# Altium schematic sheet Power.SchDoc
size A; SheetNumber: 6; SheetTotal: 17
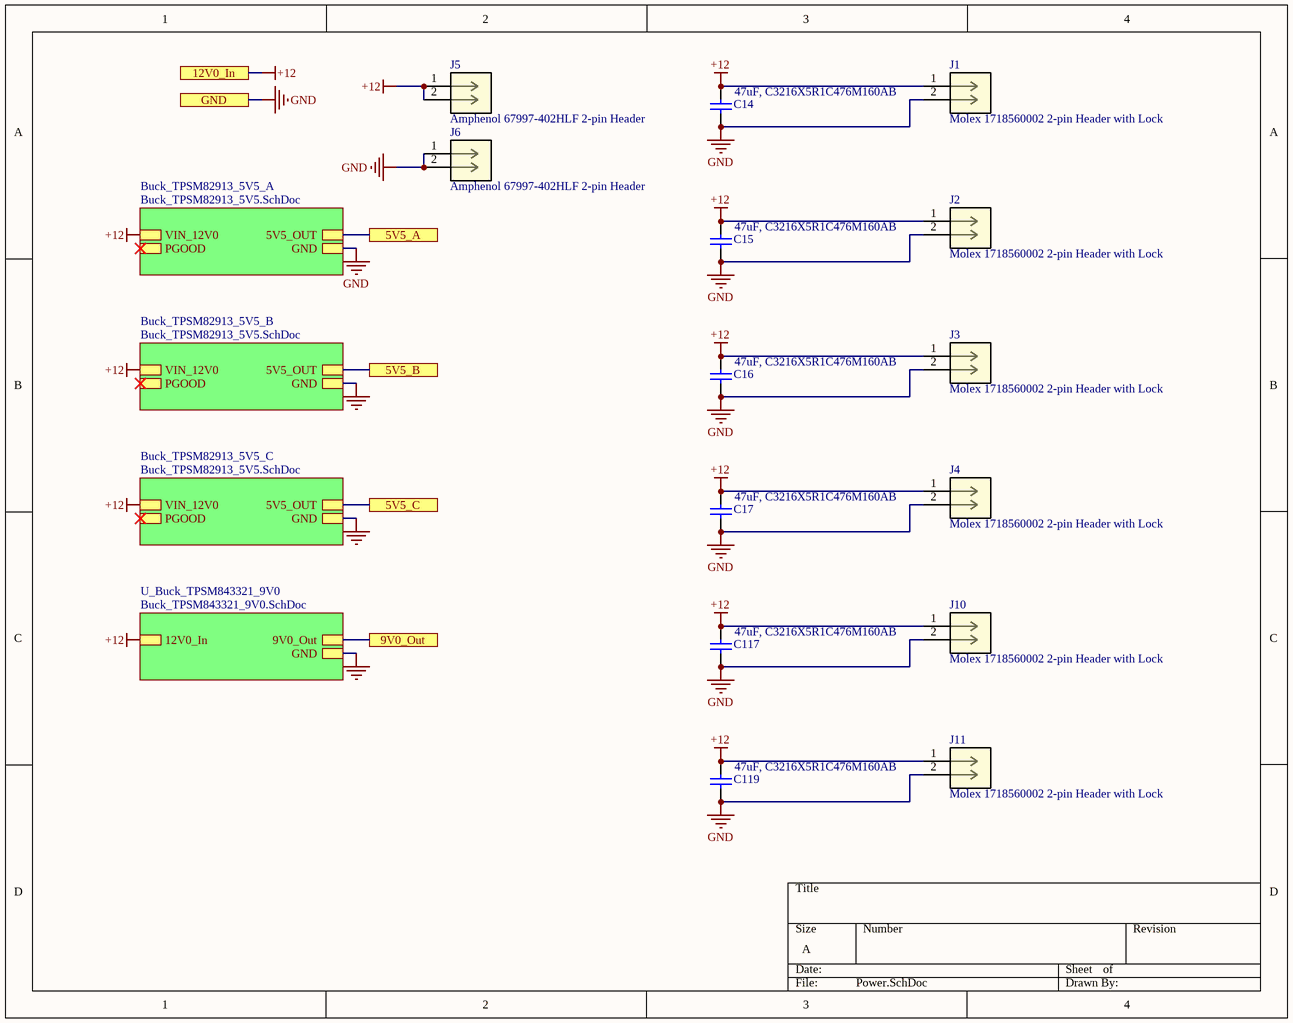
[diagram p0: Power.SchDoc]

## Parts
C14  47uF, C3216X5R1C476M160AB  [SMD-1206]
C15  47uF, C3216X5R1C476M160AB  [SMD-1206]
C16  47uF, C3216X5R1C476M160AB  [SMD-1206]
C17  47uF, C3216X5R1C476M160AB  [SMD-1206]
C117  47uF, C3216X5R1C476M160AB  [SMD-1206]
C119  47uF, C3216X5R1C476M160AB  [SMD-1206]
J1  Molex 1718560002 2-pin Header with Lock  [Molex 1718560002 2-pin header with lock]
J2  Molex 1718560002 2-pin Header with Lock  [Molex 1718560002 2-pin header with lock]
J3  Molex 1718560002 2-pin Header with Lock  [Molex 1718560002 2-pin header with lock]
J4  Molex 1718560002 2-pin Header with Lock  [Molex 1718560002 2-pin header with lock]
J5  Amphenol 67997-402HLF 2-pin Header  [Amphenol  67997-402HLF 2-pin header]
J6  Amphenol 67997-402HLF 2-pin Header  [Amphenol  67997-402HLF 2-pin header]
J10  Molex 1718560002 2-pin Header with Lock  [Molex 1718560002 2-pin header with lock]
J11  Molex 1718560002 2-pin Header with Lock  [Molex 1718560002 2-pin header with lock]

## Sub-sheets
Buck_TPSM82913_5V5_A = Buck_TPSM82913_5V5.SchDoc: GND, VIN_12V0, PGOOD, 5V5_OUT
Buck_TPSM82913_5V5_B = Buck_TPSM82913_5V5.SchDoc: GND, VIN_12V0, PGOOD, 5V5_OUT
Buck_TPSM82913_5V5_C = Buck_TPSM82913_5V5.SchDoc: GND, VIN_12V0, PGOOD, 5V5_OUT
U_Buck_TPSM843321_9V0 = Buck_TPSM843321_9V0.SchDoc: 9V0_Out, 12V0_In, GND

## Ports
5V5_A, 5V5_B, 5V5_C, 9V0_Out, 12V0_In, GND

## Nets
+12: C14.2 C15.2 C16.2 C17.2 C117.2 C119.2 J1.1 J2.1 J3.1 J4.1 J5.1 J5.2 J10.1 J11.1 ; port 12V0_In, sheet Buck_TPSM82913_5V5_A/VIN_12V0, sheet Buck_TPSM82913_5V5_B/VIN_12V0, sheet Buck_TPSM82913_5V5_C/VIN_12V0, sheet U_Buck_TPSM843321_9V0/12V0_In
GND: C14.1 C15.1 C16.1 C17.1 C117.1 C119.1 J1.2 J2.2 J3.2 J4.2 J6.1 J6.2 J10.2 J11.2 ; port GND, sheet Buck_TPSM82913_5V5_A/GND, sheet Buck_TPSM82913_5V5_B/GND, sheet Buck_TPSM82913_5V5_C/GND, sheet U_Buck_TPSM843321_9V0/GND
5V5_A: port 5V5_A, sheet Buck_TPSM82913_5V5_A/5V5_OUT
5V5_B: port 5V5_B, sheet Buck_TPSM82913_5V5_B/5V5_OUT
5V5_C: port 5V5_C, sheet Buck_TPSM82913_5V5_C/5V5_OUT
9V0_Out: port 9V0_Out, sheet U_Buck_TPSM843321_9V0/9V0_Out

## Library data of the parts
C14-C17 C117 C119 = CAP1206: Ceramic Capacitor 1206 Imperial
J1-J4 J10 J11 = Molex 1718560002 2-pin Header with Lock: No Description Available; Mfr_Name: Molex Connector Corporation; RefDes: RefDes; Type: Type
J5 J6 = Amphenol 67997-402HLF 2-pin Header: No Description Available; Mfr_Name: Amphenol ICC; RefDes: RefDes; Type: Type